# EAGLE design c3-card (EAGLE 9.4.2)

## Sheet 1 of 3: Connectors
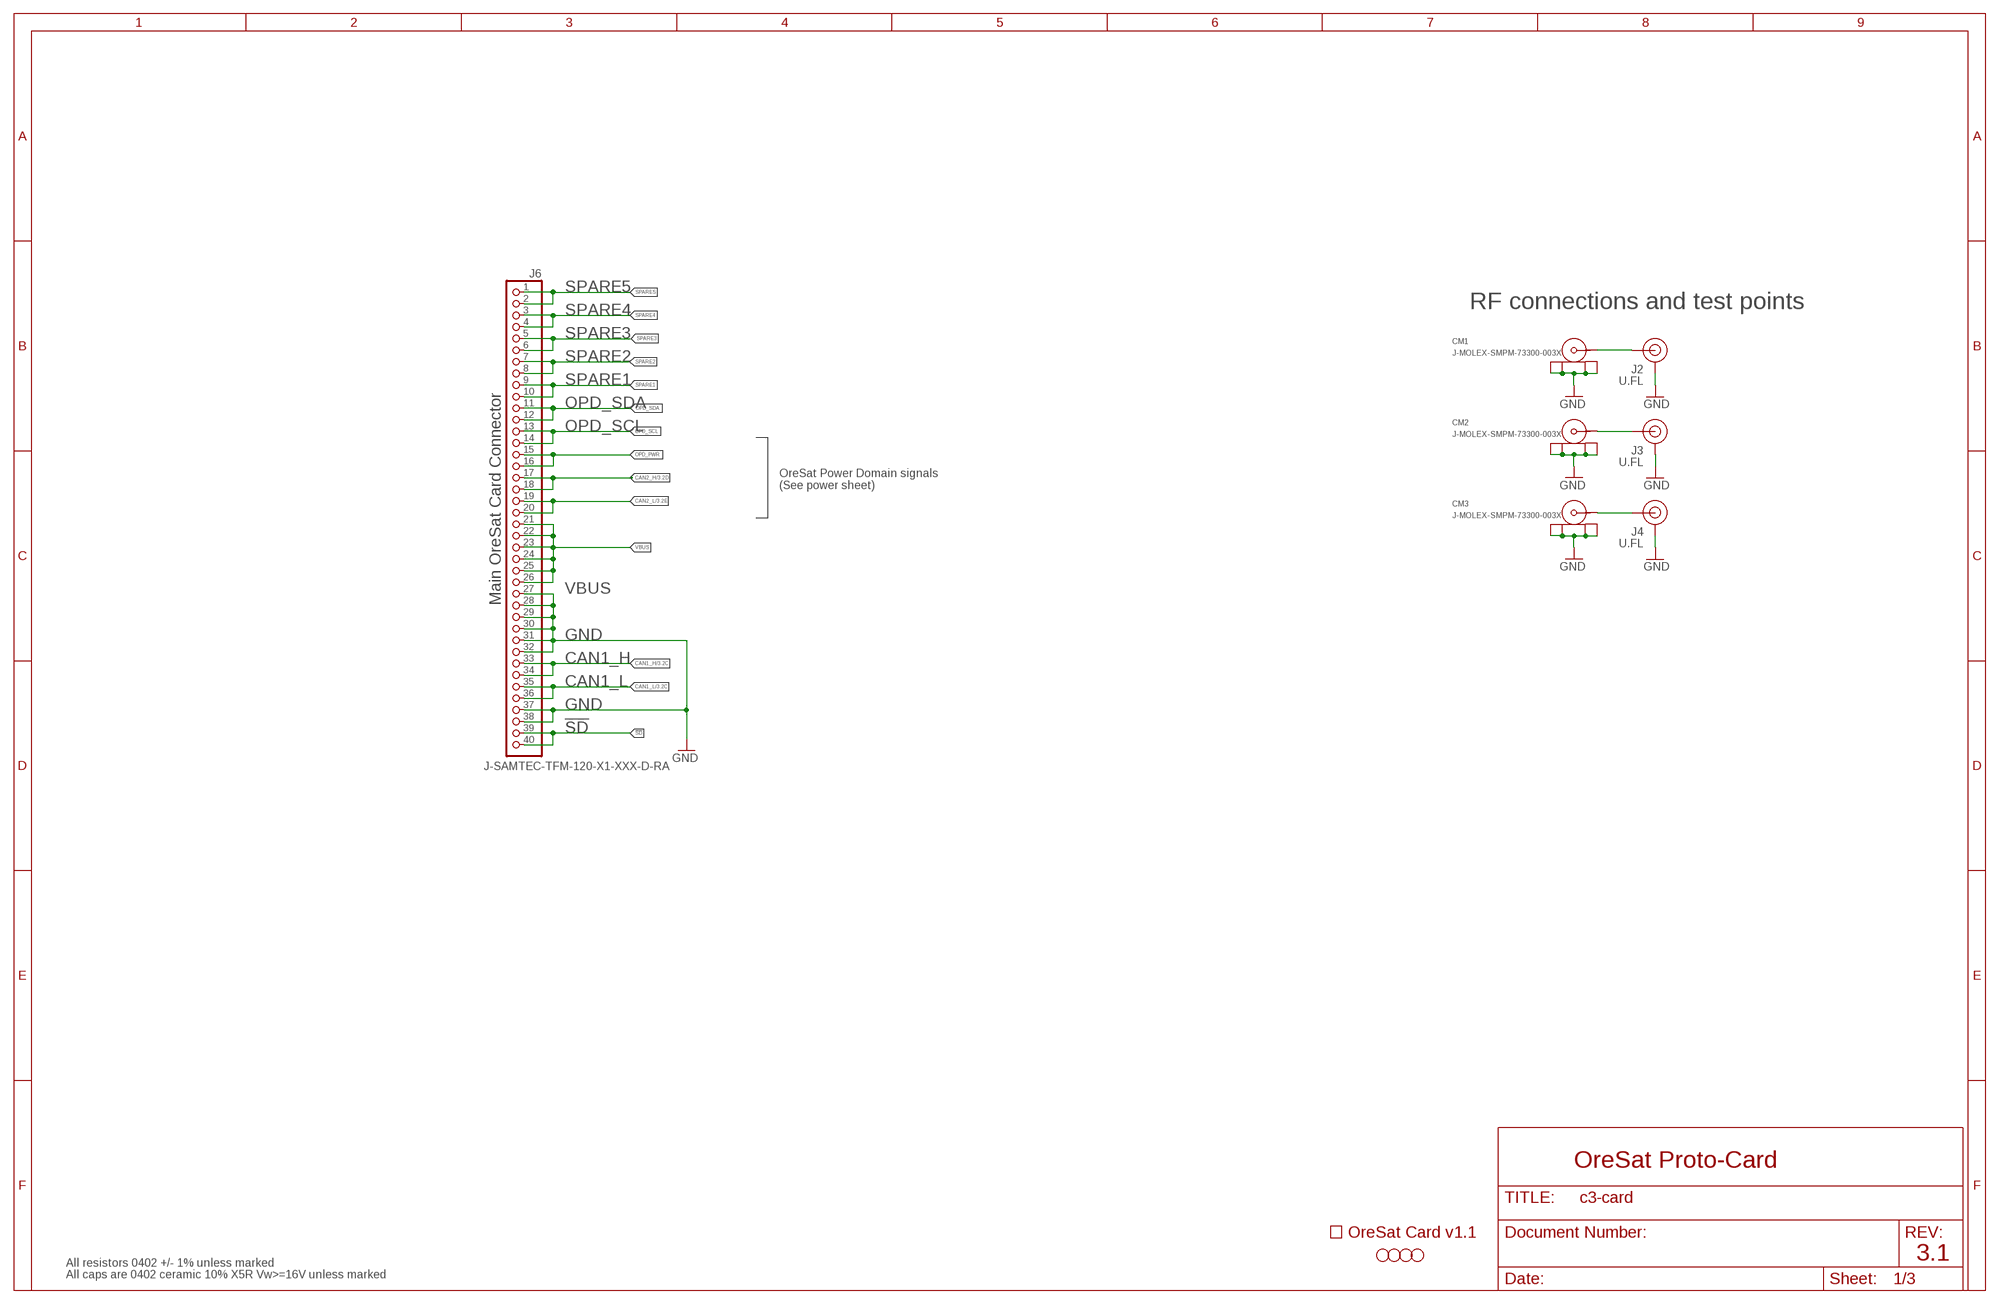
[diagram p0: schematic, sheet 1]

### Parts
CM1  J-MOLEX-SMPM-73300-003X  [J-MOLEX-SMPM-073300-003X]
CM2  J-MOLEX-SMPM-73300-003X  [J-MOLEX-SMPM-073300-003X]
CM3  J-MOLEX-SMPM-73300-003X  [J-MOLEX-SMPM-073300-003X]
H1  STAND-OFFTIGHT  [STAND-OFF-TIGHT]
H2  STAND-OFFTIGHT  [STAND-OFF-TIGHT]
H3  STAND-OFFTIGHT  [STAND-OFF-TIGHT]
H4  STAND-OFFTIGHT  [STAND-OFF-TIGHT]
J2  U.FL  U.FL2PIN  [U.FL]
J3  U.FL  U.FL2PIN  [U.FL]
J4  U.FL  U.FL2PIN  [U.FL]
J6  J-SAMTEC-TFM-120-X1-XXX-D-RA  [J-SAMTEC-TFM-120-X1-XXX-D-RA]
U$2  ORESAT-CARD-V1.1-3XRF  [ORESAT-CARD-V1.1-3XRF]

### Nets
!SD: J6.39 J6.40
CAN1_H: J6.33 J6.34 ; also sheet 3
CAN1_L: J6.35 J6.36 ; also sheet 3
CAN2_H: J6.17 J6.18 ; also sheet 3
CAN2_L: J6.19 J6.20 ; also sheet 3
GND: CM1.P$1(SHIELD3) CM1.P$2(SHIELD2) CM1.P$3(SHIELD1) CM1.P$4(SHIELD) CM2.P$1(SHIELD3) CM2.P$2(SHIELD2) CM2.P$3(SHIELD1) CM2.P$4(SHIELD) CM3.P$1(SHIELD3) CM3.P$2(SHIELD2) CM3.P$3(SHIELD1) CM3.P$4(SHIELD) J2.1(GND) J2.2(GND) J3.1(GND) J3.2(GND) J4.1(GND) J4.2(GND) J6.27 J6.28 J6.29 J6.30 J6.31 J6.32 J6.37 J6.38 ; also sheet 2,3
N$300: CM3.RF(CENTER) J4.FEED(SIGNAL)
OPD_PWR: J6.15 J6.16
OPD_SCL: J6.13 J6.14
OPD_SDA: J6.11 J6.12
RF1: CM1.RF(CENTER) J2.FEED(SIGNAL)
RF2: CM2.RF(CENTER) J3.FEED(SIGNAL)
SPARE1: J6.9 J6.10
SPARE2: J6.7 J6.8
SPARE3: J6.5 J6.6
SPARE4: J6.3 J6.4
SPARE5: J6.1 J6.2
VBUS: J6.21 J6.22 J6.23 J6.24 J6.25 J6.26 ; also sheet 2

### Notes on the sheet
- RF connections and test points
- OreSat Power Domain signals
  (See power sheet)
- Main OreSat Card Connector
- OreSat Proto-Card
- 3.1
- All resistors 0402 +/- 1% unless marked
- All caps are 0402 ceramic 10% X5R Vw>=16V unless marked

## Sheet 2 of 3: Power
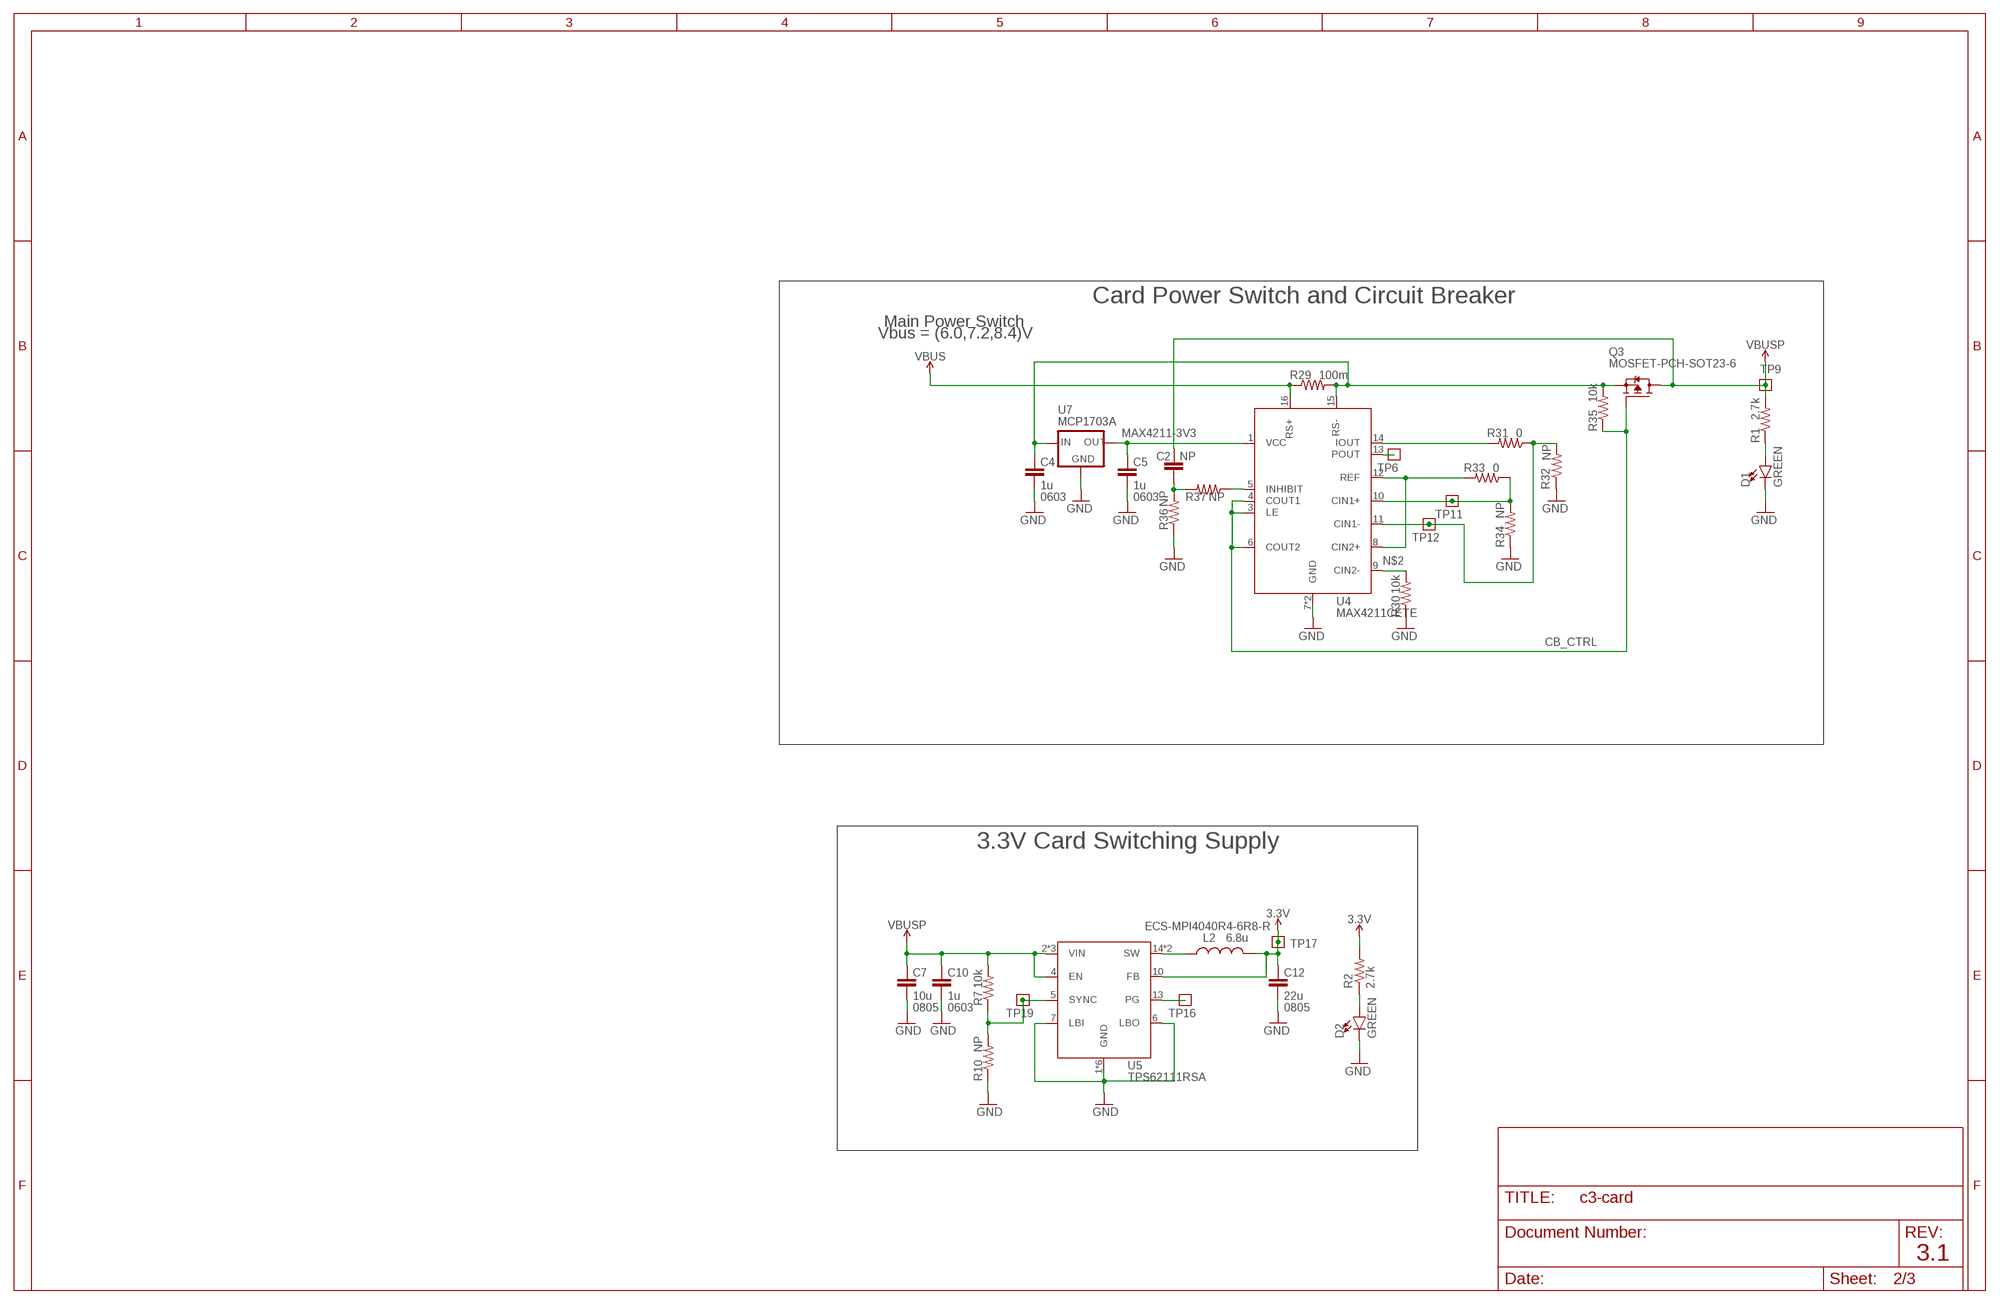
[diagram p1: schematic, sheet 2]

### Parts
C2  NP  C-EU0402-B-NOSILK  [.0402-B-NOSILK]
C4  1u  C-EU0603-B-NOSILK  [.0603-B-NOSILK]
C5  1u  C-EU0603-B-NOSILK  [.0603-B-NOSILK]
C7  10u  C-EU0805-B-NOSILK  [.0805-B-NOSILK]
C10  1u  C-EU0603-B-NOSILK  [.0603-B-NOSILK]
C12  22u  C-EU0805-B-NOSILK  [.0805-B-NOSILK]
D1  GREEN  LED-GREEN0603  [LED-0603]
D2  GREEN  LED-GREEN0603  [LED-0603]
L2  6.8u  L-ECS-MPI4040  [ECS-MPI4040]
Q3  MOSFET-PCH-SOT23-6  [SOT23-6]
R1  2.7k  R-US_0402-B-NOSILK  [.0402-B-NOSILK]
R2  2.7k  R-US_0402-B-NOSILK  [.0402-B-NOSILK]
R7  10k  R-US_0402-B-NOSILK  [.0402-B-NOSILK]
R10  NP  R-US_0402-B-NOSILK  [.0402-B-NOSILK]
R29  100m  R-US_R1206  [R1206]
R30  10k  R-US_0402-B-NOSILK  [.0402-B-NOSILK]
R31  0  R-US_0402-B-NOSILK  [.0402-B-NOSILK]
R32  NP  R-US_0402-B-NOSILK  [.0402-B-NOSILK]
R33  0  R-US_0402-B-NOSILK  [.0402-B-NOSILK]
R34  NP  R-US_0402-B-NOSILK  [.0402-B-NOSILK]
R35  10k  R-US_0402-B-NOSILK  [.0402-B-NOSILK]
R36  NP  R-US_0402-B-NOSILK  [.0402-B-NOSILK]
R37  NP  R-US_0402-B-NOSILK  [.0402-B-NOSILK]
TP6  TEST-POINT  [2MM-TEST-POINT]
TP9  TEST-POINT  [2MM-TEST-POINT]
TP11  TEST-POINT  [2MM-TEST-POINT]
TP12  TEST-POINT  [2MM-TEST-POINT]
TP16  TEST-POINT  [2MM-TEST-POINT]
TP17  TEST-POINT  [2MM-TEST-POINT]
TP19  TEST-POINT  [2MM-TEST-POINT]
U4  MAX4211CETE  MAX4211  [QFN65P400X400X80-17T210]
U5  TPS62111RSA  TPS6211X  [S-PVQFN-16]
U7  MCP1703A  XC63FPM  [SOT23]

### Nets
3.3V: C12.1 L2.2 R2.2 TP17.1 U5.10(FB) ; also sheet 3
CB_CTRL: Q3.3(G) R35.1 U4.3(LE) U4.4(COUT1) U4.6(COUT2)
GND: C4.2 C5.2 C7.2 C10.2 C12.2 D1.C D2.C R10.1 R30.1 R32.1 R34.1 R36.1 U4.7(GND) U4.EPAD(GND) U5.1(GND) U5.6(LBO) U5.7(LBI) U5.9(GND) U5.11(GND) U5.12(GND) U5.16(GND) U5.PAD(GND) U7.1(GND) ; also sheet 1,3
MAX4211-3V3: C5.1 U4.1(VCC) U7.2(OUT)
N$2: R30.2 U4.9(CIN2-)
N$270: D1.A R1.1
N$271: D2.A R2.1
N$398: C4.1 Q3.4(S) R29.2 R35.2 U4.15(RS-) U7.3(IN)
N$596: R31.1 R32.2 TP12.1 U4.11(CIN1-)
N$597: R33.1 R34.2 TP11.1 U4.10(CIN1+)
N$598: R31.2 U4.14(IOUT)
N$599: R33.2 U4.8(CIN2+) U4.12(REF)
N$600: TP6.1 U4.13(POUT)
N$603: C2.1 R36.2 R37.2
N$604: R37.1 U4.5(INHIBIT)
TPS62111-PG: TP16.1 U5.13(PG)
TPS62111-SYNC: R7.1 R10.2 TP19.1 U5.5(SYNC)
TPS62111_SW: L2.1 U5.14(SW) U5.15(SW)
VBUS: R29.1 U4.16(RS+) ; also sheet 1
VBUSP: C2.2 C7.1 C10.1 Q3.1(D) Q3.2(D) Q3.5(D) Q3.6(D) R1.2 R7.2 TP9.1 U5.2(VIN) U5.3(VIN) U5.4(EN) U5.8(VIN)

### Notes on the sheet
- Card Power Switch and Circuit Breaker
- Main Power Switch
- Vbus = (6.0,7.2,8.4)V
- 0603 | 0603
- 3.3V Card Switching Supply
- ECS-MPI4040R4-6R8-R
- 0805 | 0603 | 0805
- 3.1

## Sheet 3 of 3: Microcontroller
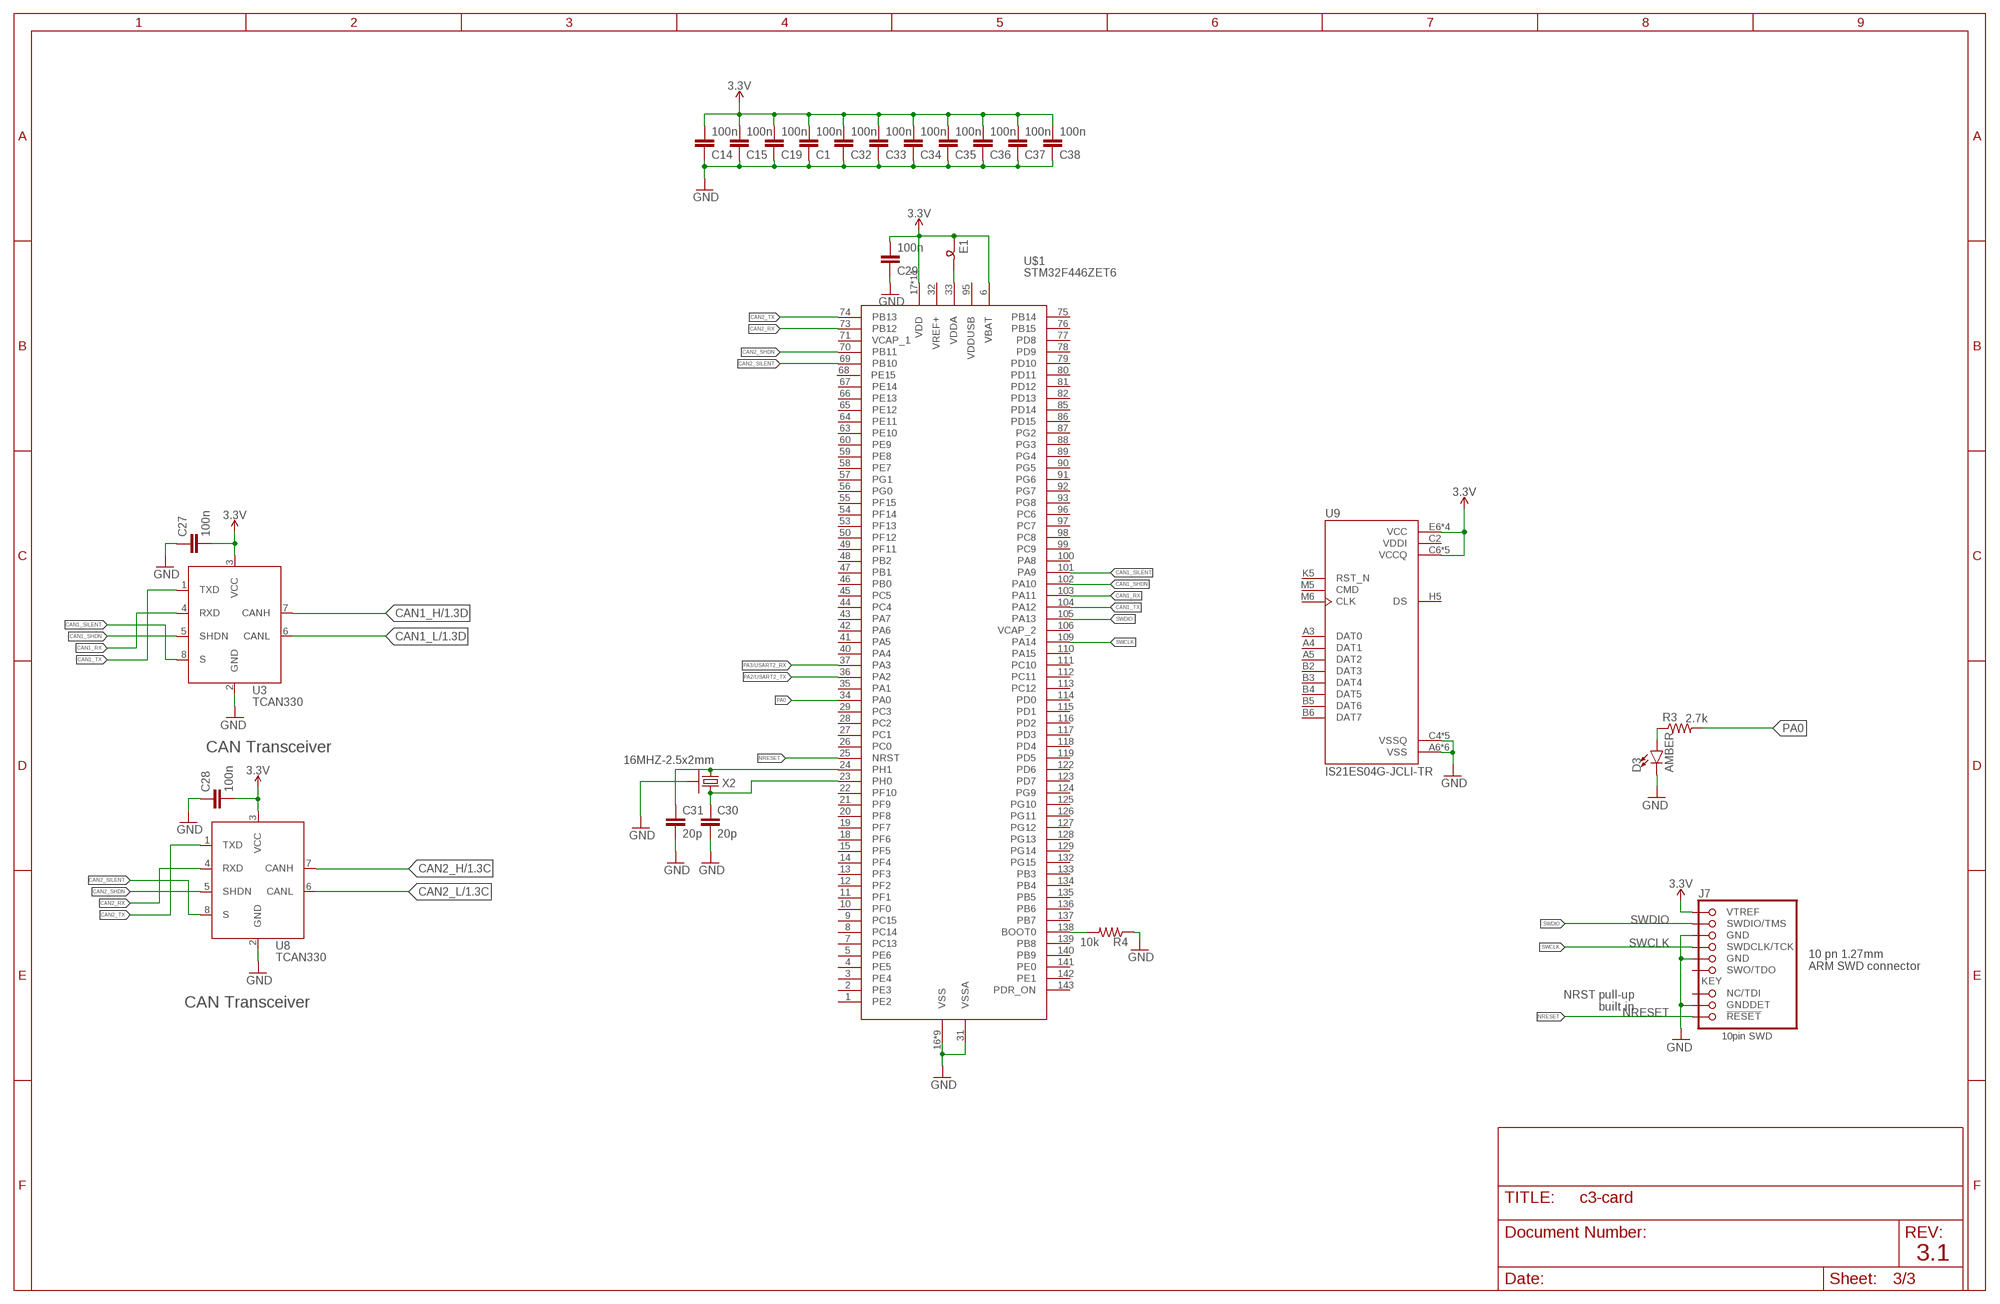
[diagram p2: schematic, sheet 3]

### Parts
C1  100n  C-EU0402-B-NOSILK  [.0402-B-NOSILK]
C14  100n  C-EU0402-B-NOSILK  [.0402-B-NOSILK]
C15  100n  C-EU0402-B-NOSILK  [.0402-B-NOSILK]
C19  100n  C-EU0402-B-NOSILK  [.0402-B-NOSILK]
C27  100n  C-EU0402-B-NOSILK  [.0402-B-NOSILK]
C28  100n  C-EU0402-B-NOSILK  [.0402-B-NOSILK]
C29  100n  C-EU0402-B-NOSILK  [.0402-B-NOSILK]
C30  20p  C-EU0402-B-NOSILK  [.0402-B-NOSILK]
C31  20p  C-EU0402-B-NOSILK  [.0402-B-NOSILK]
C32  100n  C-EU0402-B-NOSILK  [.0402-B-NOSILK]
C33  100n  C-EU0402-B-NOSILK  [.0402-B-NOSILK]
C34  100n  C-EU0402-B-NOSILK  [.0402-B-NOSILK]
C35  100n  C-EU0402-B-NOSILK  [.0402-B-NOSILK]
C36  100n  C-EU0402-B-NOSILK  [.0402-B-NOSILK]
C37  100n  C-EU0402-B-NOSILK  [.0402-B-NOSILK]
C38  100n  C-EU0402-B-NOSILK  [.0402-B-NOSILK]
D3  AMBER  LED-GREEN0603  [LED-0603]
E1  L-BEAD-0603-B  [.0603-B]
J7  FTSH-105-XX-X-DV-K  [CON10_2X5_DUK_FTSH]
R3  2.7k  R-US_0402-B-NOSILK  [.0402-B-NOSILK]
R4  10k  R-US_0402-B-NOSILK  [.0402-B-NOSILK]
U3  TCAN330  [SOT23-8_TI-DCN]
U8  TCAN330  [SOT23-8_TI-DCN]
U9  IS21ES04G-JCLI-TR  [BGA153N50P14X14_1150X1300X100]
U$1  STM32F446ZET6  [P-TQFP-144-19]
X2  16MHZ-2.5x2mm  CRYSTAL-WITH-GND  [CRYSTAL_2.5X2]

### Nets
3.3V: C1.2 C14.2 C15.2 C19.2 C27.2 C28.2 C29.2 C32.2 C33.2 C34.2 C35.2 C36.2 C37.2 C38.2 E1.1 J7.1(VTREF) U3.3(VCC) U8.3(VCC) U9.C6(VCCQ) U9.E6(VCC) U9.F5(VCC) U9.J10(VCC) U9.K9(VCC) U9.M4(VCCQ) U9.N4(VCCQ) U9.P3(VCCQ) U9.P5(VCCQ) U$1.6(VBAT) U$1.17(VDD) U$1.30(VDD) U$1.39(VDD) U$1.52(VDD) U$1.62(VDD) U$1.72(VDD) U$1.84(VDD) U$1.108(VDD) U$1.121(VDD) U$1.131(VDD) U$1.144(VDD) ; also sheet 2
CAN1_H: U3.7(CANH) ; also sheet 1
CAN1_L: U3.6(CANL) ; also sheet 1
CAN1_RX: U3.4(RXD) U$1.103(PA11)
CAN1_SHDN: U3.5(SHDN) U$1.102(PA10)
CAN1_SILENT: U3.8(S) U$1.101(PA9)
CAN1_TX: U3.1(TXD) U$1.104(PA12)
CAN2_H: U8.7(CANH) ; also sheet 1
CAN2_L: U8.6(CANL) ; also sheet 1
CAN2_RX: U8.4(RXD) U$1.73(PB12)
CAN2_SHDN: U8.5(SHDN) U$1.70(PB11)
CAN2_SILENT: U8.8(S) U$1.69(PB10)
CAN2_TX: U8.1(TXD) U$1.74(PB13)
CRYSTALIN1: C31.1 U$1.24(PH1) X2.1
CRYSTALOUT1: C30.1 U$1.23(PH0) X2.3
GND: C1.1 C14.1 C15.1 C19.1 C27.1 C28.1 C29.1 C30.2 C31.2 C32.1 C33.1 C34.1 C35.1 C36.1 C37.1 C38.1 D3.C J7.3(GND) J7.5(GND) J7.9(GNDDET) R4.1 U3.2(GND) U8.2(GND) U9.A6(VSS) U9.C4(VSSQ) U9.E7(VSS) U9.G5(VSS) U9.H10(VSS) U9.J5(VSS) U9.K8(VSS) U9.N2(VSSQ) U9.N5(VSSQ) U9.P4(VSSQ) U9.P6(VSSQ) U$1.16(VSS) U$1.31(VSSA) U$1.38(VSS) U$1.51(VSS) U$1.61(VSS) U$1.83(VSS) U$1.94(VSS) U$1.107(VSS) U$1.120(VSS) U$1.130(VSS) X2.2(SHIELD) X2.4(SHIELD) ; also sheet 1,2
N$1: D3.A R3.1
N$3: R4.2 U$1.138(BOOT0)
N$4: E1.2 U$1.33(VDDA)
NRESET: J7.10(!RESET) U$1.25(NRST)
PA0: R3.2 U$1.34(PA0)
PA2/USART2_TX: U$1.36(PA2)
PA3/USART2_RX: U$1.37(PA3)
SWCLK: J7.4(SWDCLK/TCK) U$1.109(PA14)
SWDIO: J7.2(SWDIO/TMS) U$1.105(PA13)
Unconnected: J7.6(SWO/TDO) J7.8(NC/TDI) U9.A3(DAT0) U9.A4(DAT1) U9.A5(DAT2) U9.B2(DAT3) U9.B3(DAT4) U9.B4(DAT5) U9.B5(DAT6) U9.B6(DAT7) U9.H5(DS) U9.K5(RST_N) U9.M5(CMD) U9.M6(CLK) U$1.1(PE2) U$1.2(PE3) U$1.3(PE4) U$1.4(PE5) U$1.5(PE6) U$1.7(PC13) U$1.8(PC14) U$1.9(PC15) U$1.10(PF0) U$1.11(PF1) U$1.12(PF2) U$1.13(PF3) U$1.14(PF4) U$1.15(PF5) U$1.18(PF6) U$1.19(PF7) U$1.20(PF8) U$1.21(PF9) U$1.22(PF10) U$1.26(PC0) U$1.27(PC1) U$1.28(PC2) U$1.29(PC3) U$1.32(VREF+) U$1.35(PA1) U$1.40(PA4) U$1.41(PA5) U$1.42(PA6) U$1.43(PA7) U$1.44(PC4) U$1.45(PC5) U$1.46(PB0) U$1.47(PB1) U$1.48(PB2) U$1.49(PF11) U$1.50(PF12) U$1.53(PF13) U$1.54(PF14) U$1.55(PF15) U$1.56(PG0) U$1.57(PG1) U$1.58(PE7) U$1.59(PE8) U$1.60(PE9) U$1.63(PE10) U$1.64(PE11) U$1.65(PE12) U$1.66(PE13) U$1.67(PE14) U$1.68(PE15) U$1.71(VCAP_1) U$1.75(PB14) U$1.76(PB15) U$1.77(PD8) U$1.78(PD9) U$1.79(PD10) U$1.80(PD11) U$1.81(PD12) U$1.82(PD13) U$1.85(PD14) U$1.86(PD15) U$1.87(PG2) U$1.88(PG3) U$1.89(PG4) U$1.90(PG5) U$1.91(PG6) U$1.92(PG7) U$1.93(PG8) U$1.95(VDDUSB) U$1.96(PC6) U$1.97(PC7) U$1.98(PC8) U$1.99(PC9) U$1.100(PA8) U$1.106(VCAP_2) U$1.110(PA15) U$1.111(PC10) U$1.112(PC11) U$1.113(PC12) U$1.114(PD0) U$1.115(PD1) U$1.116(PD2) U$1.117(PD3) U$1.118(PD4) U$1.119(PD5) U$1.122(PD6) U$1.123(PD7) U$1.124(PG9) U$1.125(PG10) U$1.126(PG11) U$1.127(PG12) U$1.128(PG13) U$1.129(PG14) U$1.132(PG15) U$1.133(PB3) U$1.134(PB4) U$1.135(PB5) U$1.136(PB6) U$1.137(PB7) U$1.139(PB8) U$1.140(PB9) U$1.141(PE0) U$1.142(PE1) U$1.143(PDR_ON)

### Notes on the sheet
- CAN Transceiver
- 10 pn 1.27mm 
  ARM SWD connector
- CAN Transceiver
- NRST pull-up
  built in
- 3.1

## Power pins joined to a net without a drawn wire
VDDI: U9.C2(VDDI)

## Library data of the parts
C1 C2 C14 C15 C19 C27-C29 C32-C38 = rcl_custom:C-EU: CAPACITOR, European symbol; DIS: Digi-Key; DPN: 1276-1001-1-ND; MFR: Samsung; MPN: CL05B104KO5NNNC
C4 C5 C10 = oresat-rcl:C-EU: CAPACITOR, European symbol; DIS: Digi-Key; DPN: 1276-1001-1-ND; MFR: Samsung; MPN: CL05B104KO5NNNC
C7 C12 = oresat-rcl:C-EU: CAPACITOR, European symbol
C30 C31 = rcl_custom:C-EU: CAPACITOR, European symbol; DIS: Digi-Key; DPN: 1276-6601-1-ND; MFR: Samsung; MPN: CL05C200JB51PNC
CM1-CM3 = J-Molex-SMPM-73300-003X:J-MOLEX-SMPM-73300-003X; MFR: Molex; MPN: 73300-0020
D1 D2 = SparkFun-LED:LED-GREEN: Green SMD LED Used in manufacturing of various products at SparkFun Packages: 0603 - SMD 0603 package [Product Link] <http://www.futureelectronics.com/en/technologies/semiconductors/optoelectronics/leds/Pages/9894312-LTST-C190GKT.aspx?CrossPart=HSMG-C190&IM=0> LilyPad 1206 - SMD1206 LilyPad package [Product Link] <http://www.futureelectronics.com/en/Technologies/Product.aspx?ProductID=IN150NGHARVATEKCORPORATION2049943&IM=0> 1206 - SMD1206 package [Product Link] <http://www.futureelectronics.com/en/technologies/semiconductors/optoelectronics/leds/Pages/8315665-LTST-C150KGKT.aspx?IM=0> 1206 Bottom Mount -SMD 1206 Bottom Mount [Product Link] <http://www.digikey.com/product-detail/en/lite-on-inc/LTST-C230KGKT/160-1456-1-ND/386854> SparkFun Products: Pro Mini 328 -5V <https://www.sparkfun.com/products/821> RedBoard <https://www.sparkfun.com/products/12757> MP3 Trigger <https://www.sparkfun.com/products/13720> Makey Makey <https://www.sparkfun.com/products/11076>
D3 = SparkFun-LED:LED-GREEN: Green SMD LED Used in manufacturing of various products at SparkFun Packages: 0603 - SMD 0603 package [Product Link] <http://www.futureelectronics.com/en/technologies/semiconductors/optoelectronics/leds/Pages/9894312-LTST-C190GKT.aspx?CrossPart=HSMG-C190&IM=0> LilyPad 1206 - SMD1206 LilyPad package [Product Link] <http://www.futureelectronics.com/en/Technologies/Product.aspx?ProductID=IN150NGHARVATEKCORPORATION2049943&IM=0> 1206 - SMD1206 package [Product Link] <http://www.futureelectronics.com/en/technologies/semiconductors/optoelectronics/leds/Pages/8315665-LTST-C150KGKT.aspx?IM=0> 1206 Bottom Mount -SMD 1206 Bottom Mount [Product Link] <http://www.digikey.com/product-detail/en/lite-on-inc/LTST-C230KGKT/160-1456-1-ND/386854> SparkFun Products: Pro Mini 328 -5V <https://www.sparkfun.com/products/821> RedBoard <https://www.sparkfun.com/products/12757> MP3 Trigger <https://www.sparkfun.com/products/13720> Makey Makey <https://www.sparkfun.com/products/11076>; PROD_ID: DIO-00821; VALUE: GREEN
E1 = oresat-rcl:L-BEAD-*: Bead or Chip inductor ("ferrite bead") for EMI suppression
H1-H4 = SparkFun-Hardware:STAND-OFF: Stand Off Drill holes for mechanically mounting via screws, standoffs, etc. Note: Use the keepout ring to avoid running the screw head into surrounding components. Variant Overviews STAND-OFF - Mechanical footprint for a #4 phillips button head screw. STAND-OFF-TIGHT - Mechanical footprint for a #4 phillips button head screw, Example SparkFun Products Screw - Phillips Head (1/4", 4-40, 10 pack) <https://www.sparkfun.com/products/10453> (PRT-10453) Screw - Phillips Head (1/2", 4-40, 10 pack) <https://www.sparkfun.com/products/10452> (PRT-10452) Screw - Phillips Head (3/4", 4-40, 10 pack) <https://www.sparkfun.com/products/10451> (PRT-10451) Screw - Phillips Head (1", 4-40, 10 pack) <https://www.sparkfun.com/products/10450> (PRT-10450)
J2-J4 = SparkFun-Connectors:U.FL2PIN: SMD Antenna Connector - U.FL 2mm height, 3.0mm x 3.0mm receptacle size. SparkFun Products: SparkFun WiFi Shield - ESP8266 <https://www.sparkfun.com/products/13287> SparkFun ESP8266 Thing <https://www.sparkfun.com/products/13231> SparkFun MiniGen - Pro Mini Signal Generator Shield <https://www.sparkfun.com/products/11420>; PROD_ID: CONN-09193; SF_ID: WRL-09144
J6 = J-Samtec-TFM-120-X1-XXX-D-RA:J-SAMTEC-TFM-120-X1-XXX-D-RA; MFR: Samtec; MPN: TFM-120-01-L-D-RA
J7 = J-Samtec-FTSH-105-XXX-DV-K-ARM-SWD:FTSH-105-XX-X-DV-K; MFR: Samtec; MPN: FTSH-105-01-F-DV-K
L2 = L-ECS-MPI4040:L-ECS-MPI4040; MFR: ECS; MPN: ECS-MPI4040R4-6R8-R
Q3 = Q-MOSFET-PCH-SOT23-6:MOSFET-PCH-SOT23-6: P channel MOSFET in an SOT23-6; MFR: Diodes Inc; MPN: DMP3050LVT-7
R1-R4 R7 R10 R30-R37 = rcl_custom:R-US_: RESISTOR, American symbol; DIS: Digi-Key; DPN: 1276-4275-1-ND; MFR: Samsung; MPN: RC1005F6653CS
R29 = rcl:R-US_: RESISTOR, American symbol; SPICEPREFIX: R
TP6 TP9 TP11 TP12 TP16 TP17 TP19 = Tova:TEST-POINT
U3 U8 = TCAN330:TCAN330; MFR: Texas Instruments; MPN: TCAN330GDCNT
U4 = U-Maxim-MAX4211-power-monitor:MAX4211; MFR: Maxim; MPN: MAX4211CETE
U5 = U-TI-TPS6211x-SPS-buck:TPS6211X: TPS6211x 17-V, 1.5-A, Synchronous Step-Down Converter; MFR: TI; MPN: TPS62111RSA
U7 = v-reg:XC63FP: Positiv Voltage Regulators www.torex.co.jp/english/product/pro02/pdf/0201_xc62fp.pdf; MFR: Microchip; MPN: MCP1703AT-3302E/CB
U9 = IS21ES04G-JCLI-TR:IS21ES04G-JCLI-TR: IC FLASH 32G EMMC 153VFBGA; AVAILABILITY: Unavailable; DESCRIPTION: IC FLASH 32G EMMC 153VFBGA; MF: ISSI, Integrated Silicon Solution Inc; MP: IS21ES04G-JCLI-TR; PACKAGE: VFBGA-153 ISSI, Integrated Silicon Solution Inc; PRICE: None
U$1 = U-ST-STM32F446RE-uC:STM32F446ZET6
U$2 = oresat-cards:ORESAT-CARD-V1.1
X2 = low-gain-radio:CRYSTAL-WITH-GND; DIS: Digi-Key; DPN: XC2181CT-ND; MFR: ECS Inc.; MPN: ECS-160-10-36Q-ES-TR

## Board
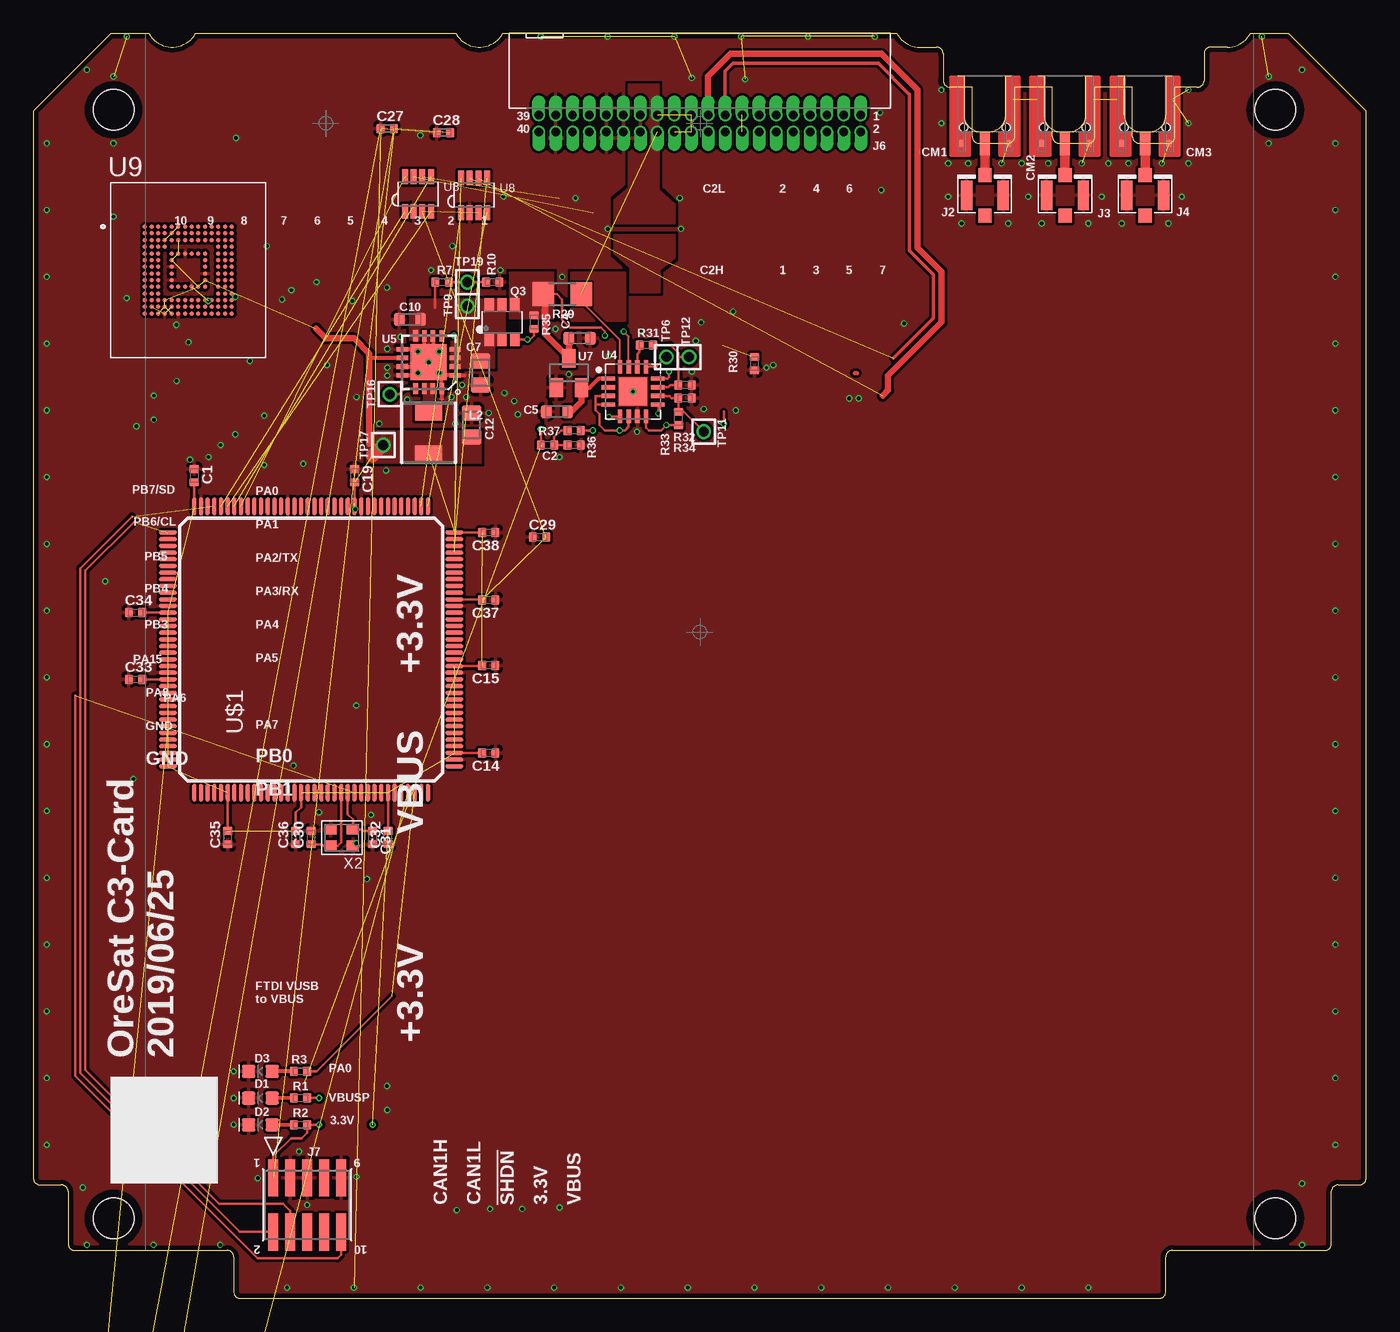
[diagram p3: board, top side]
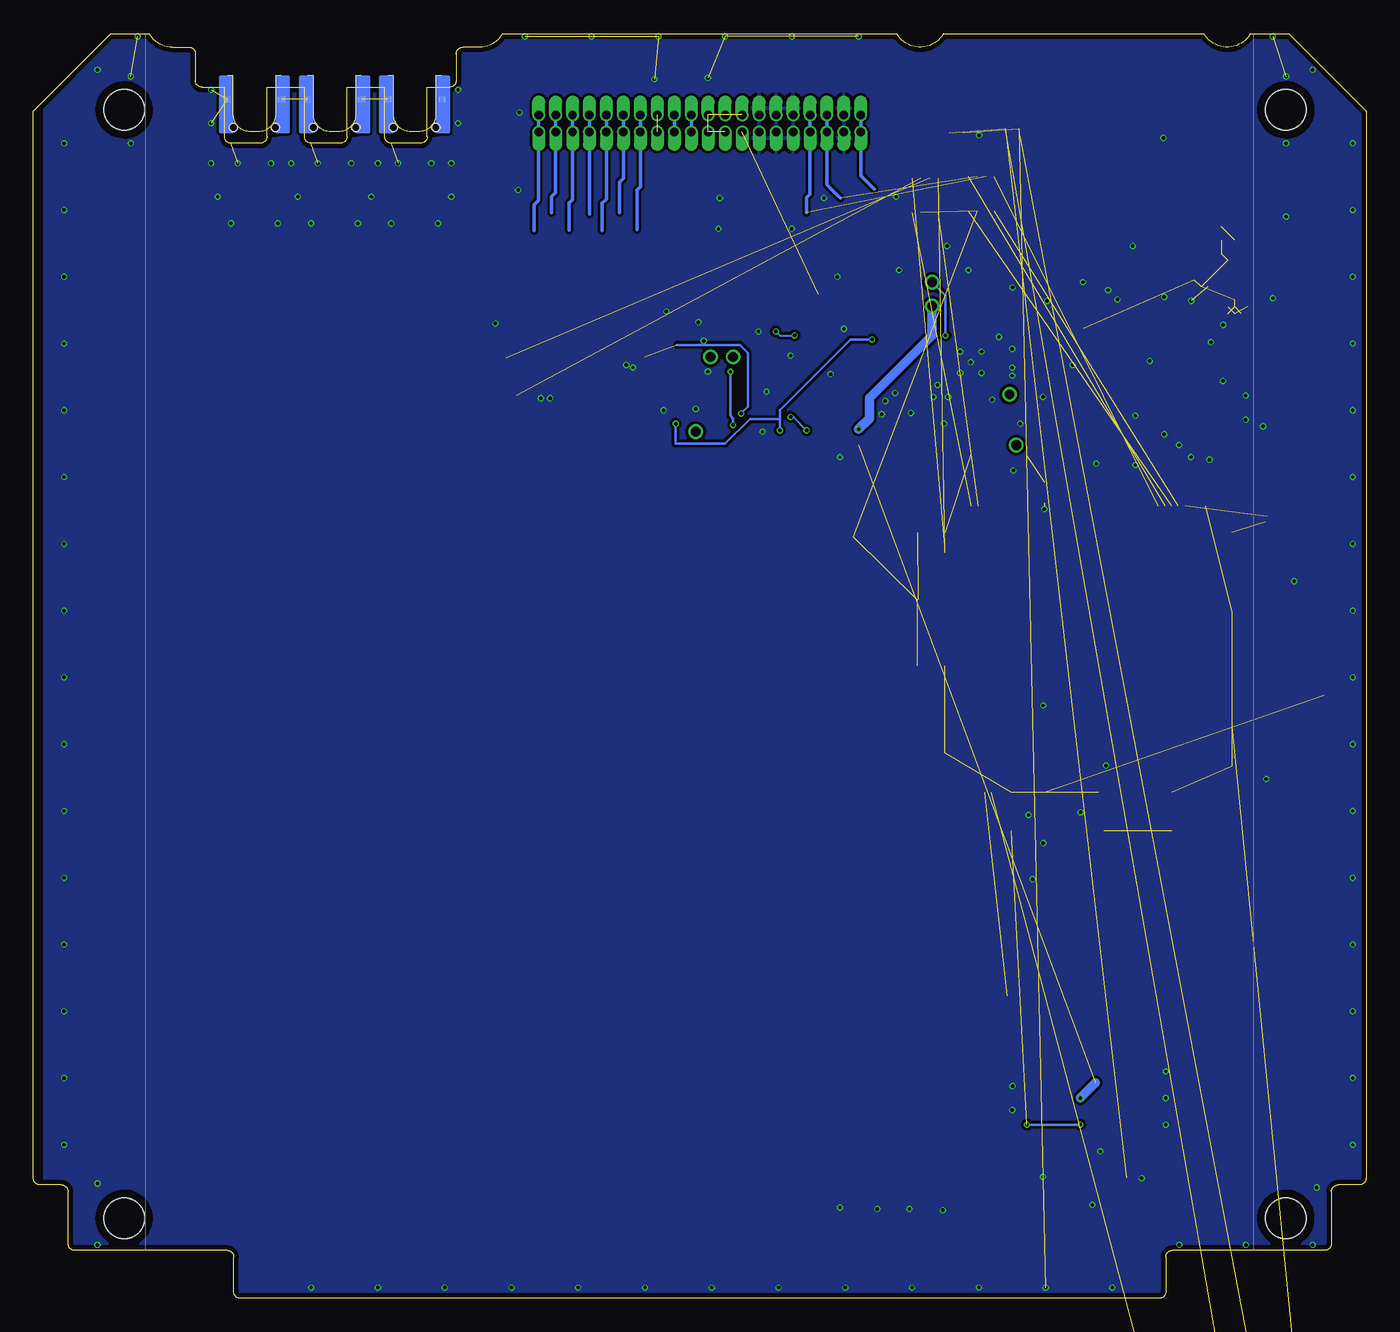
[diagram p4: board, bottom side, seen from below]

Size 99.8 x 94.7 mm. Coordinates in mm from the lower left corner, seen from the top.
Copper layers (1*2*15*16): Top 0.035559375mm / dielectric 0.17018125mm / Route2 0.01778125mm / dielectric 47mil / route 0.01778125mm / dielectric 0.17018125mm / Bottom 0.035559375mm
Design rules "oshpark-4layer-tented": minimum track width 5mil, minimum drill 10mil, track to track 5mil, track to pad 5mil, pad to pad 5mil, via to via 5mil, smd to smd 5mil, copper to edge 15mil, drill to drill 6mil, minimum pad ring 4mil, minimum via ring 4mil, stop-mask expansion 2.5mil, vias tented up to drill 20mil, thermal gap 10mil

### Footprints (pad centres in the part's own frame; a part is rotated, then mirrored left to right if it is on the bottom)
.0402-B-NOSILK = smd 0.6 x 0.7: 1 -0.5,0; 2 0.5,0
.0603-B-NOSILK = smd 0.8 x 0.95: 1 -0.8,0; 2 0.8,0
.0805-B-NOSILK = smd 1.15 x 1.45: 1 -0.9,0; 2 0.9,0
J-MOLEX-SMPM-073300-003X = smd 0.508 x 0.508: P$1 -1.778,-5.08; P$2 1.778,-5.08 | smd 0.508 x 0.508 bottom: P$3 -2.032,-1.778; P$4 2.032,-1.778 | smd 0.762 x 1.778: RF 0,-5.08 | hole 0.61: 1.587,-3.886; -1.587,-3.886
LED-0603 = smd 1 x 1: A -0.877,0; C 0.877,0
.0603-B = smd 0.8 x 0.95: 1 -0.8,0; 2 0.8,0
STAND-OFF-TIGHT = hole 3.048: 0,0
U.FL = smd 2.2 x 0.85: 1 0,1.375; 2 0,-1.375 | smd 1.05 x 1: FEED 1.525,0; NC -1.525,0
J-SAMTEC-TFM-120-X1-XXX-D-RA = drill 0.635 pad 0.965 offset: 1 12.065,0.635; 2 12.065,-0.635; 3 10.795,0.635; 4 10.795,-0.635; 5 9.525,0.635; 6 9.525,-0.635; 7 8.255,0.635; 8 8.255,-0.635; 9 6.985,0.635; 10 6.985,-0.635; 11 5.715,0.635; 12 5.715,-0.635; 13 4.445,0.635; 14 4.445,-0.635; 15 3.175,0.635; 16 3.175,-0.635; 17 1.905,0.635; 18 1.905,-0.635; 19 0.635,0.635; 20 0.635,-0.635; 21 -0.635,0.635; 22 -0.635,-0.635; 23 -1.905,0.635; 24 -1.905,-0.635; 25 -3.175,0.635; 26 -3.175,-0.635; 27 -4.445,0.635; 28 -4.445,-0.635; 29 -5.715,0.635; 30 -5.715,-0.635; 31 -6.985,0.635; 32 -6.985,-0.635; 33 -8.255,0.635; 34 -8.255,-0.635; 35 -9.525,0.635; 36 -9.525,-0.635; 37 -10.795,0.635; 38 -10.795,-0.635; 39 -12.065,0.635; 40 -12.065,-0.635
CON10_2X5_DUK_FTSH = smd 0.762 x 2.794: 1 2.54,-2.032; 2 2.54,2.032; 3 1.27,-2.032; 4 1.27,2.032; 5 0,-2.032; 6 0,2.032; 7 -1.27,-2.032; 8 -1.27,2.032; 9 -2.54,-2.032; 10 -2.54,2.032
ECS-MPI4040 = smd 2 x 1.3: 1 0,1.575; 2 0,-1.575
SOT23-6 = smd 0.7 x 1: 1 -0.95,-1.3; 2 0,-1.3; 3 0.95,-1.3; 4 0.95,1.3; 5 0,1.3; 6 -0.95,1.3
R1206 = smd 1.6 x 1.803: 1 -1.422,0; 2 1.422,0
2MM-TEST-POINT = drill 0.737: 1 0,0
SOT23-8_TI-DCN = smd 0.45 x 1.1: 1 -0.975,-1.3; 2 -0.325,-1.3; 3 0.325,-1.3; 4 0.975,-1.3; 5 0.975,1.3; 6 0.325,1.3; 7 -0.325,1.3; 8 -0.975,1.3
QFN65P400X400X80-17T210 = smd 1.01 x 0.32: 1 -1.86,0.975; 2 -1.86,0.325; 3 -1.86,-0.325; 4 -1.86,-0.975; 9 1.86,-0.975; 10 1.86,-0.325; 11 1.86,0.325; 12 1.86,0.975 | smd 0.32 x 1.01: 5 -0.975,-1.86; 6 -0.325,-1.86; 7 0.325,-1.86; 8 0.975,-1.86; 13 0.975,1.86; 14 0.325,1.86; 15 -0.325,1.86; 16 -0.975,1.86 | smd 2.1 x 2.1: EPAD 0,0
S-PVQFN-16 = smd 0.85 x 0.35: 1 -1.975,0.975; 2 -1.975,0.325; 3 -1.975,-0.325; 4 -1.975,-0.975; 9 1.975,-0.975; 10 1.975,-0.325; 11 1.975,0.325; 12 1.975,0.975 | smd 0.35 x 0.85: 5 -0.975,-1.975; 6 -0.325,-1.975; 7 0.325,-1.975; 8 0.975,-1.975; 13 0.975,1.975; 14 0.325,1.975; 15 -0.325,1.975; 16 -0.975,1.975 | smd 2.7 x 2.7: PAD 0,0
SOT23 = smd 1 x 1.4: 1 -0.95,-1.1; 2 0.95,-1.1; 3 0,1.1
BGA153N50P14X14_1150X1300X100 = smd 0.35 x 0.35: A1 -3.25,3.25; A2 -2.75,3.25; A3 -2.25,3.25; A4 -1.75,3.25; A5 -1.25,3.25; A6 -0.75,3.25; A7 -0.25,3.25; A8 0.25,3.25; A9 0.75,3.25; A10 1.25,3.25; A11 1.75,3.25; A12 2.25,3.25; A13 2.75,3.25; A14 3.25,3.25; B1 -3.25,2.75; B2 -2.75,2.75; B3 -2.25,2.75; B4 -1.75,2.75; B5 -1.25,2.75; B6 -0.75,2.75; B7 -0.25,2.75; B8 0.25,2.75; B9 0.75,2.75; B10 1.25,2.75; B11 1.75,2.75; B12 2.25,2.75; B13 2.75,2.75; B14 3.25,2.75; C1 -3.25,2.25; C2 -2.75,2.25; C3 -2.25,2.25; C4 -1.75,2.25; C5 -1.25,2.25; C6 -0.75,2.25; C7 -0.25,2.25; C8 0.25,2.25; C9 0.75,2.25; C10 1.25,2.25; C11 1.75,2.25; C12 2.25,2.25; C13 2.75,2.25; C14 3.25,2.25; D1 -3.25,1.75; D2 -2.75,1.75; D3 -2.25,1.75; D4 -1.75,1.75; D12 2.25,1.75; D13 2.75,1.75; D14 3.25,1.75; E1 -3.25,1.25; E2 -2.75,1.25; E3 -2.25,1.25; E5 -1.25,1.25; E6 -0.75,1.25; E7 -0.25,1.25; E8 0.25,1.25; E9 0.75,1.25; E10 1.25,1.25; E12 2.25,1.25; E13 2.75,1.25; E14 3.25,1.25; F1 -3.25,0.75; F2 -2.75,0.75; F3 -2.25,0.75; F5 -1.25,0.75; F10 1.25,0.75; F12 2.25,0.75; F13 2.75,0.75; F14 3.25,0.75; G1 -3.25,0.25; G2 -2.75,0.25; G3 -2.25,0.25; G5 -1.25,0.25; G10 1.25,0.25; G12 2.25,0.25; G13 2.75,0.25; G14 3.25,0.25; H1 -3.25,-0.25; H2 -2.75,-0.25; H3 -2.25,-0.25; H5 -1.25,-0.25; H10 1.25,-0.25; H12 2.25,-0.25; H13 2.75,-0.25; H14 3.25,-0.25; J1 -3.25,-0.75; J2 -2.75,-0.75; J3 -2.25,-0.75; J5 -1.25,-0.75; J10 1.25,-0.75; J12 2.25,-0.75; J13 2.75,-0.75; J14 3.25,-0.75; K1 -3.25,-1.25; K2 -2.75,-1.25; K3 -2.25,-1.25; K5 -1.25,-1.25; K6 -0.75,-1.25; K7 -0.25,-1.25; K8 0.25,-1.25; K9 0.75,-1.25; K10 1.25,-1.25; K12 2.25,-1.25; K13 2.75,-1.25; K14 3.25,-1.25; L1 -3.25,-1.75; L2 -2.75,-1.75; L3 -2.25,-1.75; L12 2.25,-1.75; L13 2.75,-1.75; L14 3.25,-1.75; M1 -3.25,-2.25; M2 -2.75,-2.25; M3 -2.25,-2.25; M4 -1.75,-2.25; M5 -1.25,-2.25; M6 -0.75,-2.25; M7 -0.25,-2.25; M8 0.25,-2.25; M9 0.75,-2.25; M10 1.25,-2.25; M11 1.75,-2.25; M12 2.25,-2.25; M13 2.75,-2.25; M14 3.25,-2.25; N1 -3.25,-2.75; N2 -2.75,-2.75; N3 -2.25,-2.75; N4 -1.75,-2.75; N5 -1.25,-2.75; N6 -0.75,-2.75; N7 -0.25,-2.75; N8 0.25,-2.75; N9 0.75,-2.75; N10 1.25,-2.75; N11 1.75,-2.75; N12 2.25,-2.75; N13 2.75,-2.75; N14 3.25,-2.75; P1 -3.25,-3.25; P2 -2.75,-3.25; P3 -2.25,-3.25; P4 -1.75,-3.25; P5 -1.25,-3.25; P6 -0.75,-3.25; P7 -0.25,-3.25; P8 0.25,-3.25; P9 0.75,-3.25; P10 1.25,-3.25; P11 1.75,-3.25; P12 2.25,-3.25; P13 2.75,-3.25; P14 3.25,-3.25
P-TQFP-144-19 = smd 1.35 x 0.29: 1 -10.725,8.75; 2 -10.725,8.25; 3 -10.725,7.75; 4 -10.725,7.25; 5 -10.725,6.75; 6 -10.725,6.25; 7 -10.725,5.75; 8 -10.725,5.25; 9 -10.725,4.75; 10 -10.725,4.25; 11 -10.725,3.75; 12 -10.725,3.25; 13 -10.725,2.75; 14 -10.725,2.25; 15 -10.725,1.75; 16 -10.725,1.25; 17 -10.725,0.75; 18 -10.725,0.25; 19 -10.725,-0.25; 20 -10.725,-0.75; 21 -10.725,-1.25; 22 -10.725,-1.75; 23 -10.725,-2.25; 24 -10.725,-2.75; 25 -10.725,-3.25; 26 -10.725,-3.75; 27 -10.725,-4.25; 28 -10.725,-4.75; 29 -10.725,-5.25; 30 -10.725,-5.75; 31 -10.725,-6.25; 32 -10.725,-6.75; 33 -10.725,-7.25; 34 -10.725,-7.75; 35 -10.725,-8.25; 36 -10.725,-8.75; 73 10.725,-8.75; 74 10.725,-8.25; 75 10.725,-7.75; 76 10.725,-7.25; 77 10.725,-6.75; 78 10.725,-6.25; 79 10.725,-5.75; 80 10.725,-5.25; 81 10.725,-4.75; 82 10.725,-4.25; 83 10.725,-3.75; 84 10.725,-3.25; 85 10.725,-2.75; 86 10.725,-2.25; 87 10.725,-1.75; 88 10.725,-1.25; 89 10.725,-0.75; 90 10.725,-0.25; 91 10.725,0.25; 92 10.725,0.75; 93 10.725,1.25; 94 10.725,1.75; 95 10.725,2.25; 96 10.725,2.75; 97 10.725,3.25; 98 10.725,3.75; 99 10.725,4.25; 100 10.725,4.75; 101 10.725,5.25; 102 10.725,5.75; 103 10.725,6.25; 104 10.725,6.75; 105 10.725,7.25; 106 10.725,7.75; 107 10.725,8.25; 108 10.725,8.75 | smd 0.29 x 1.35: 37 -8.75,-10.725; 38 -8.25,-10.725; 39 -7.75,-10.725; 40 -7.25,-10.725; 41 -6.75,-10.725; 42 -6.25,-10.725; 43 -5.75,-10.725; 44 -5.25,-10.725; 45 -4.75,-10.725; 46 -4.25,-10.725; 47 -3.75,-10.725; 48 -3.25,-10.725; 49 -2.75,-10.725; 50 -2.25,-10.725; 51 -1.75,-10.725; 52 -1.25,-10.725; 53 -0.75,-10.725; 54 -0.25,-10.725; 55 0.25,-10.725; 56 0.75,-10.725; 57 1.25,-10.725; 58 1.75,-10.725; 59 2.25,-10.725; 60 2.75,-10.725; 61 3.25,-10.725; 62 3.75,-10.725; 63 4.25,-10.725; 64 4.75,-10.725; 65 5.25,-10.725; 66 5.75,-10.725; 67 6.25,-10.725; 68 6.75,-10.725; 69 7.25,-10.725; 70 7.75,-10.725; 71 8.25,-10.725; 72 8.75,-10.725; 109 8.75,10.725; 110 8.25,10.725; 111 7.75,10.725; 112 7.25,10.725; 113 6.75,10.725; 114 6.25,10.725; 115 5.75,10.725; 116 5.25,10.725; 117 4.75,10.725; 118 4.25,10.725; 119 3.75,10.725; 120 3.25,10.725; 121 2.75,10.725; 122 2.25,10.725; 123 1.75,10.725; 124 1.25,10.725; 125 0.75,10.725; 126 0.25,10.725; 127 -0.25,10.725; 128 -0.75,10.725; 129 -1.25,10.725; 130 -1.75,10.725; 131 -2.25,10.725; 132 -2.75,10.725; 133 -3.25,10.725; 134 -3.75,10.725; 135 -4.25,10.725; 136 -4.75,10.725; 137 -5.25,10.725; 138 -5.75,10.725; 139 -6.25,10.725; 140 -6.75,10.725; 141 -7.25,10.725; 142 -7.75,10.725; 143 -8.25,10.725; 144 -8.75,10.725
CRYSTAL_2.5X2 = smd 0.9 x 0.8: 1 -0.825,-0.625; 2 0.825,-0.625; 3 0.825,0.625; 4 -0.825,0.625

### Placement (x,y rotation side)
C1  12.05,61.6 270 top
C2  38.5,63.9 180 top
C4  40.9,71.9 0 top
C5  39.2,66.4 180 top
C7  33.5,69.3 270 top
C10  28.2,73.3 180 top
C12  32.8,65.4 90 top
C14  34.1,40.85 180 top
C15  34.1,47.4 180 top
C19  24.05,61.6 270 top
C27  26.5,87.6 0 top
C28  30.7,87.3 0 top
C29  37.9,57 0 top
C30  20.8,34.5 90 top
C31  25.4,34.5 270 top
C32  26.55,34.5 90 top
C33  7.65,46.35 0 top
C34  7.65,51.35 0 top
C35  14.55,34.5 90 top
C36  19.65,34.5 90 top
C37  34.1,52.3 180 top
C38  34.1,57.35 180 top
CM1  71.25,91.56 0 top
CM2  77.25,91.56 0 top
CM3  83.25,91.56 0 top
D1  17,15 180 top
D2  17,13 180 top
D3  17,17 180 top
E1  3.6,-51.4 0 top  (outside the outline)
H1  93,6 0 top
H2  93,89 0 top
H3  6,89 0 top
H4  6,6 0 top
J2  71.25,82.6 90 top
J3  77.25,82.6 90 top
J4  83.25,82.6 90 top
J6  49.9,88 0 top
J7  20.5,7 180 top
L2  29.6,64.8 0 top
Q3  35.1,73.1 0 top
R1  20,15 0 top
R2  20,13 0 top
R3  20,17 0 top
R4  0.3,-51 0 top  (outside the outline)
R7  30.6,76.1 180 top
R10  34.4,76.1 180 top
R29  39.6,75.2 180 top
R30  54,70 90 top
R31  45.9,71.4 180 top
R32  48.8,68.4 180 top
R33  48.3,65.9 270 top
R34  48.8,67.4 180 top
R35  37.5,73.1 90 top
R36  40.5,63.9 180 top
R37  40.5,65 180 top
TP6  47.4,70.5 0 top
TP9  32.5,74.3 0 top
TP11  50.2,64.9 0 top
TP12  49.1,70.5 0 top
TP16  26.7,67.7 180 top
TP17  26.2,63.9 180 top
TP19  32.5,76.1 0 top
U3  28.8,82.7 0 top
U4  44.9,67.9 0 top
U5  29.6,70.1 180 top
U7  40.1,69.3 0 top
U8  33,82.6 0 top
U9  11.6,77 0 top
U$1  20.8,48.6 90 top
U$2  0,0 0 top
X2  23.1,34.5 180 top

### Tracks (layer width: path | path; a pad name or v marks a point on that pad's centre or on a via)
3.3V  (via drill 0.25)  (29 unrouted)
  Top 0.2: v21.4,13 R2.2 20.5,12.4 20.1,12 19.3,12 17.96,10.66 J7.1 | U$1.121 C34.2 | U$1.108 C1.2 | C19.2 24.05,59.56 | U$1.131 C33.2 | U$1.62 33.55,52.35 C37.2 | U$1.52 33.35,47.35 C15.2 | U$1.39 C14.2 | U$1.30 C32.2 | U$1.17 20.05,36.77 19.65,36.38 C36.2 | U$1.6 C35.2 | U$1.72 C38.2
  Top 0.3: U5.10 25.18,70.42 25.15,70.5
  Top 0.5: 21.18,72.62 21.9,71.9 24,71.9 25.15,70.75 25.15,70.5 25.15,64
  Top 1: 25.4,63.1 TP17.1
  Bottom 0.2: v21.4,13 v25.4,13
  pour Top (no thermals): 25,64.9 33.5,64.9 33.5,62.6 25,62.6
!SD
  Bottom 0.25: J6.39 J6.40 37.84,84.06 36.83,83.06
CAN1_H  (1 unrouted)
  Bottom 0.25: J6.33 J6.34 41.65,82.69 41.9,82.43 41.9,81.29
CAN1_L  (1 unrouted)
  Bottom 0.25: J6.35 J6.36 40.38,83.41 39.37,82.4
CAN1_RX  (1 unrouted)
CAN1_SHDN  (1 unrouted)
CAN1_SILENT  (1 unrouted)
CAN1_TX  (1 unrouted)
CAN2_H  (1 unrouted)
  Top 0.25: 65.5,71.5 64.4,70.4 | 65.5,90.27 63.27,92.5 52.4,92.5 51.8,91.91 J6.17
  Top 0.254: 65.5,90.27 65.6,90.17 65.6,78.47 67.41,76.67 67.41,73.41 65.5,71.5
  Bottom 0.25: J6.17 J6.18
CAN2_L  (1 unrouted)
  Top 0.5: J6.19 50.53,91.53 52.2,93.2 63.5,93.2 66.2,90.5 66.2,78.7 68,76.9 68,73.1 64,69.1 64,68 63.6,67.6
  Bottom 0.25: J6.19 J6.20
CAN2_RX  (1 unrouted)
CAN2_SHDN  (1 unrouted)
CAN2_SILENT  (1 unrouted)
CAN2_TX  (1 unrouted)
CB_CTRL  (via drill 0.25)
  Top 0.2: R35.1 37.5,72.1 37.2,71.8 v37,71.8 Q3.3 | U4.6 44.58,65.28 44.3,65 v43.9,65 42.8,65 42.4,65.4 42.4,66.22 42.1,66.53 42.1,66.92 | U4.4 42.1,66.92 | U4.3 42.1,67.58 42.1,66.92 | v51.7,65.5 51.7,66.4
  Bottom 0.2: v43.9,65 43.9,65.9 | 43.9,65.9 43.9,66.5 38.6,71.8 v37,71.8 | v51.7,65.5 51.7,64 48,64 46.15,65.85 43.95,65.85 43.9,65.9
CRYSTALIN1
  Top 0.2: U$1.24 23.55,36.25 23.93,35.88 X2.1 24.57,35.12 24.7,35 C31.1
CRYSTALOUT1
  Top 0.2: U$1.23 23.05,34.15 22.77,33.88 X2.3 21.73,33.88 21.6,34 C30.1
GND  (via drill 0.25)  (22 unrouted)
  Top 0.3: 30.57,69.12 U5.16 30.57,67.38 | 30.57,69.12 U5.1 32.27,69.12 | 30.57,69.12 U5.PAD | U5.6 29.93,70.42 U5.PAD | U5.7 29.27,70.42 U5.PAD | U5.9 28.62,71.08 U5.PAD | U5.11 29.27,69.78 U5.PAD | U5.12 28.62,69.12 U5.PAD
  other vias: 11.62,71.6 21.2,76.1 16.2,70.2 19.32,75.5 7.72,65.3 4,4 23.88,74.7 97.5,11.5 1,11.5 1,16.5 1,21.5 1,26.5 1,31.5 1,36.5 1,41.5 1,46.5 1,51.5 1,56.5 1,61.5 1,66.5 1,71.5 1,76.5 1,81.5 1,86.5 6,86.5 6,91.5 97.5,16.5 97.5,21.5 97.5,26.5 97.5,31.5 97.5,36.5 97.5,41.5 97.5,46.5 97.5,51.5 97.5,56.5 97.5,61.5 97.5,66.5 97.5,71.5 97.5,76.5 97.5,81.5 97.5,86.5 92.5,86.5 92.5,91.5 18.62,74.8 15.12,64.7 14.02,63.9 13.12,63 11.72,62.8 9.02,65.8 9.02,67.6 10.72,68.7 15.12,75 95,8.6 95,4 3.7,8.3 9,4 14,4 19,0.8 24,0.8 29,0.8 39,0.8 44,0.8 49,0.8 54,0.8 59,0.8 64,0.8 69,0.8 74,0.8 86.5,90.5 86.5,88 86.5,85 84.5,85 82,85 80.5,85 78.5,85 76,85 74,85 72.5,85 70,85 68.5,85 68,88 68,90.5 73,80.5 69.5,80.5 75.5,80.5 79,80.5 81.5,80.5 85,80.5 86,82.5 80,82.5 74.5,82.5 68.5,82.5 13.1,74.7 10.7,72.9 21.98,69.9 6.98,74.9 5.38,53.7 19.48,39.9 7.48,38.9 25.28,36.2 21.38,36.4 24.98,31.4 16.8,9 19.9,11 26.5,14.1 26.5,69.1 26.5,69.7 27.5,72 26.5,71.1 29.6,70.1 30.4,69.3 28.8,69.3 28.8,70.9 30.4,70.9 32.1,68.4 31.3,67.5 32.4,67.5 34.1,66.3 55.4,69.9 61.1,67.4 61.8,67.4 35.28,67.8 36.28,66.2 39.4,63 44.9,67.9 45.2,64.9 52.6,66.5 49.3,69.4 50.2,66.6 50,73.1 52.4,73.9 54.9,69.7 45.5,72.4 49.6,71.7 34.98,77 28,67.3 39.6,76.5 40.6,82.4 35.2,82.5 43,80.1 48.5,80.1 48.4,82.4 63.4,88.8 53.3,91.3 49.3,91.4 65.2,73 63.5,83 43.1,70.6 39.1,72.6 40.1,69.2 36,67.2 31.6,65.5 25.9,65.5 26.4,62 24.2,67.5 24.1,59.1 20.2,62.5 17.28,66.1 17.28,62.4 24.18,44.4 24.18,34.1 26.48,15.9 39.4,6.8 36.6,6.7 34.2,6.7 31.7,6.6 34,0.8 79,0.8 38,94.5 43,94.5 48,94.5 53,94.5 58,94.5 63,94.5 92,94.5 4,92 95,92 7,94.5 29.78,77 31.38,78.8 26.48,75.7 17.48,78.8 15.18,86.9 28.98,87.1 6,81 20.5,7 15,13 15,15 15,17 24.2,9.1
  pour Top (isolate 0.2, rank 6): 0,0 99.8,0 99.8,94.7 0,94.7
  pour Bottom (isolate 0.2, rank 6): 0,0 99,0 99,95.3 0,95.3
MAX4211-3V3
  Top 0.3: U4.1 42.33,68.88 41.65,68.2 U7.2
  Top 0.5: U7.2 41.05,67.15 40.3,66.4 C5.1
N$1
  Top 0.3: R3.1 D3.A
N$2  (via drill 0.25)  (1 unrouted)
  Top 0.2: R30.2 54.08,70.58 | U4.9 46.8,66.89 v46.8,66.26
  Bottom 0.2: v46.8,66.26 46.3,66.76 46.3,70.8 46.9,71.4 51.6,71.4
N$3  (1 unrouted)
N$4  (1 unrouted)
N$270
  Top 0.25: R1.1 D1.A
N$271
  Top 0.25: R2.1 D2.A
N$300
  Top 0.7: CM3.RF J4.FEED
N$398  (via drill 0.25)
  Top 0.152: R29.2 38.3,75.2 39.2,75.2 | v44.2,72.4 44.58,72.03 U4.15
  Top 0.2: v42.8,72.1 42.8,72.4 42.5,72.7 40.2,72.7 39.6,73.3 39.6,74.8 39.2,75.2
  Top 0.5: C4.1 U7.3 38.3,72.2 38.3,75.2
  Bottom 0.152: v44.2,72.4 43.9,72.1 v42.8,72.1
  pour Top (no thermals): 38.8,73.4 38.9,73.4 38.9,76.8 35.7,76.8 35.7,73.4
N$593
  pour Top (no thermals): 44.3,76.8 44.3,73.2 40.3,73.2 40.3,76.8
N$596
  Top 0.2: R31.1 47.7,71.4 48.3,70.8 48.3,70.5 | 48.3,70.5 R32.2 47.7,68.4 47.52,68.22 U4.11 | TP12.1 48.3,70.5
N$597
  Top 0.2: U4.10 47.62,67.58 47.8,67.4 R34.2 R33.1 48.7,66.4 TP11.1
N$598
  Top 0.2: U4.14 45.23,70.72 45.4,70.9 R31.2
N$599  (via drill 0.25)
  Top 0.2: R33.2 v47.4,65.4 47,65 46.1,65 45.88,65.22 U4.8 | U4.12 47.48,68.88 47.6,69 v47.6,69.4
  Bottom 0.2: v47.6,69.4 47.6,66.1 47.4,65.9 v47.4,65.4
N$600
  Top 0.2: U4.13 46.66,69.76 TP6.1
N$603
  Top 0.2: R37.2 39.5,65 39,64.5 C2.1 R36.2
N$604  (via drill 0.25)  (1 unrouted)
  Top 0.2: U4.5 43.14,66.04 v43.1,66 | v41.9,65 R37.1
  Bottom 0.2: v41.9,65 42.9,66 v43.1,66
NRESET  (1 unrouted)
  Top 0.2: J7.10 23.04,3.26 22.78,3 16.8,3 3.15,16.65 3.15,45.15
OPD_PWR  (1 unrouted)
OPD_SCL
  Bottom 0.25: J6.13 J6.14 54.34,83.25 54.6,83 54.6,80.02
OPD_SDA
  Bottom 0.25: J6.11 J6.12 55.62,83.89 55.9,83.6 55.9,81.3
PA0  (1 unrouted)
  Top 0.152: 21.7,17.5 26.85,22.65
  Top 0.2: 21.7,17.5 21.2,17 R3.2
RF1
  Top 0.7: CM1.RF J2.FEED
RF2
  Top 0.7: CM2.RF J3.FEED
SPARE1
  Bottom 0.25: J6.9 J6.10 56.88,82.31 57.2,82 57.2,79.96
SPARE2
  Bottom 0.25: J6.7 J6.8 58.16,81.18
SPARE3
  Bottom 0.25: J6.5 J6.6 59.42,82.28 59.7,82 59.7,80
SPARE4
  Bottom 0.25: J6.3 J6.4 60.7,82.81 61,82.5 61,81.32
SPARE5
  Bottom 0.25: J6.1 J6.2 61.97,82.23 62.3,81.9 62.3,79.94
SWCLK  (1 unrouted)
  Top 0.2: J7.4 19.23,6.57 18.7,7.1 13.9,7.1 3.9,17.1 3.9,54.5 7.55,58.15
SWDIO  (1 unrouted)
  Top 0.2: J7.2 15.43,4.97 3.5,16.9 3.5,54.66 7.39,58.55
TPS62111-PG
  Top 0.2: U5.13 27.82,68.12 27.4,67.7 TP16.1
TPS62111-SYNC  (via drill 0.25)
  Top 0.2: U5.5 31.48,72.08 v31.5,72.1 | R10.2 TP19.1 R7.1
  Bottom 0.2: v31.5,72.1 31.5,75.1 TP19.1
TPS62111_SW
  pour Top (no thermals): 29.9,68.4 29.3,68.4 29.3,66.2 29.9,66.2
VBUS  (5 unrouted)
  Top 0.152: R29.1 40.5,75.2 43.92,71.78 U4.16
  pour Top (isolate 0.2, no thermals): 48,80.53 48,81.93 46.8,83.03 46.8,90.9 44.6,90.9 44.6,83.13 43.5,82.23 43.5,80.53
  pour Top (isolate 0.2, no thermals): 43.5,79.63 43.5,78.23 44.7,77.13 44.7,75.34 46.9,75.34 46.9,77.03 48,77.93 48,79.63
VBUSP  (via drill 0.25)  (1 unrouted)
  Top 0.2: C2.2 v38,65.1 | R7.2 30.1,74.2 | R1.2 v21.4,15
  Bottom 0.7: TP9.1 32.5,72.1 37.2,67.4 37.2,65.9 v38,65.1 | 20.27,16.13 v21.4,15
  pour Top (no thermals): 35.3,71.4 35.3,74.8 28.2,74.8 28.2,71.8 31.3,71.8 31.3,69.7 34.5,69.7 34.5,71.4
VPD
  Top 0.3: 61.67,69.29 61.5,69.29

### Text on the board
tPlace: C2L | 2 | 4 | 6 | 10 | 9 | 8 | 7 | 6 | 5 | 4 | 3 | 2 | 1 | C2H | 1 | 3 | 5 | 7 | PB7/SD | PA0 | PB6/CL | PA1 | PB5 | PA2/TX | PB4 | PA3/RX | PB3 | PA4 | PA15 | PA5 | +3.3V | PA8 | PA6 | GND | PA7 | GND | PB0 | PB1 | VBUS | FTDI VUSB / to VBUS | +3.3V | OreSat C3-Card | 2019/06/25 | PA0 | VBUSP | 3.3V | CAN1H | CAN1L | !SHDN | 3.3V | VBUS